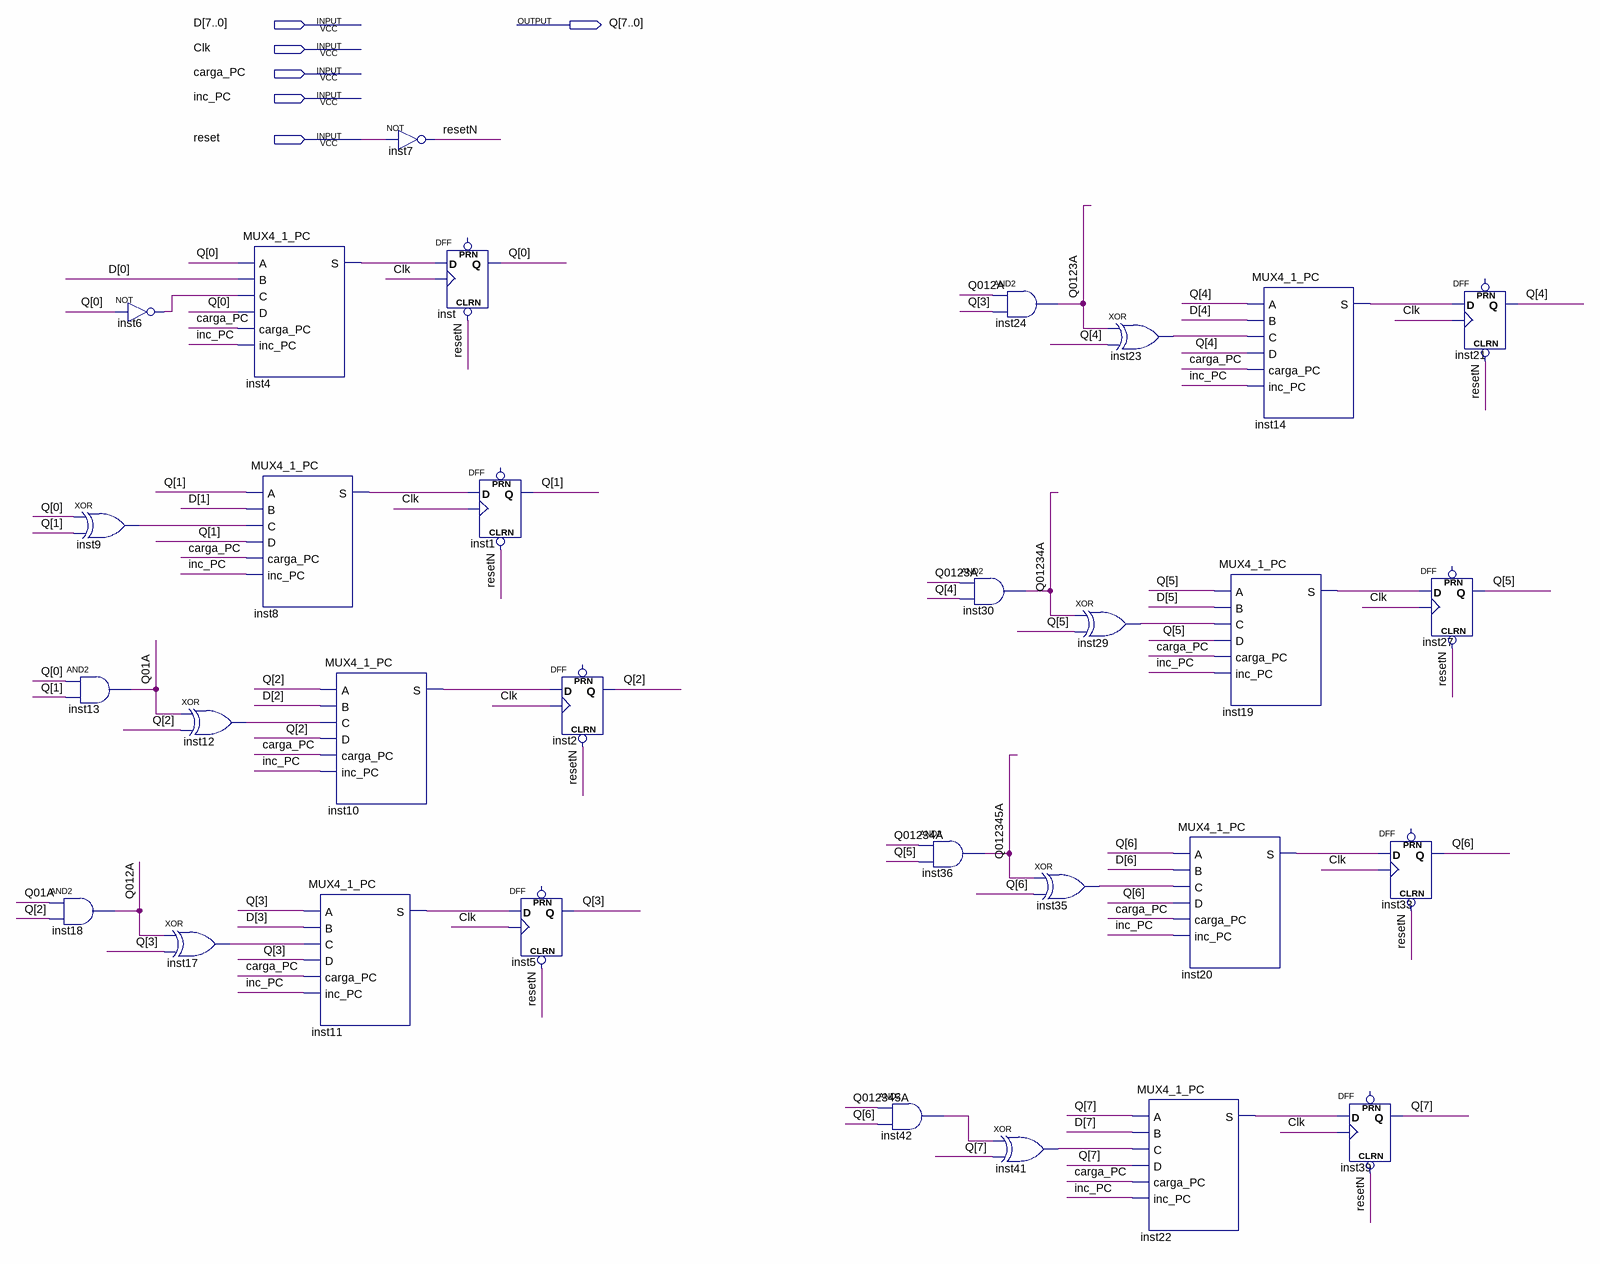
[diagram p0: schematic sheet]
// Quartus schematic PC.bdf as structural Verilog: 31 symbols, 6 pins
module PC (
  input  [7:0] D,
  input  Clk,
  input  carga_PC,
  input  inc_PC,
  input  reset,
  output [7:0] Q
);

  wire inst4_s, inst6_out, inst8_s, inst9_out, inst10_s, inst11_s, inst12_out, inst14_s, inst17_out,
       inst19_s, inst20_s, inst22_s, inst23_out, inst29_out, inst35_out, inst41_out, inst42_out, Q01A, Q012A,
       Q0123A, Q01234A, Q012345A, resetN;

  xor inst9 (inst9_out, Q[0], Q[1]);
  and inst13 (Q01A, Q[0], Q[1]);
  and inst18 (Q012A, Q01A, Q[2]);
  not inst6 (inst6_out, Q[0]);
  xor inst17 (inst17_out, Q012A, Q[3]);
  MUX4_1_PC inst4 (.A(Q[0]), .B(D[0]), .C(inst6_out), .D(Q[0]), .carga_PC(carga_PC), .inc_PC(inc_PC), .S(inst4_s));
  xor inst12 (inst12_out, Q01A, Q[2]);
  MUX4_1_PC inst8 (.A(Q[1]), .B(D[1]), .C(inst9_out), .D(Q[1]), .carga_PC(carga_PC), .inc_PC(inc_PC), .S(inst8_s));
  MUX4_1_PC inst11 (.A(Q[3]), .B(D[3]), .C(inst17_out), .D(Q[3]), .carga_PC(carga_PC), .inc_PC(inc_PC), .S(inst11_s));
  MUX4_1_PC inst10 (.A(Q[2]), .B(D[2]), .C(inst12_out), .D(Q[2]), .carga_PC(carga_PC), .inc_PC(inc_PC), .S(inst10_s));
  not inst7 (resetN, reset);
  DFF inst (.CLRN(resetN), .CLK(Clk), .D(inst4_s), .Q(Q[0]));  // open: PRN
  DFF inst1 (.CLRN(resetN), .CLK(Clk), .D(inst8_s), .Q(Q[1]));  // open: PRN
  DFF inst2 (.CLRN(resetN), .CLK(Clk), .D(inst10_s), .Q(Q[2]));  // open: PRN
  DFF inst5 (.CLRN(resetN), .CLK(Clk), .D(inst11_s), .Q(Q[3]));  // open: PRN
  and inst42 (inst42_out, Q012345A, Q[6]);
  and inst30 (Q01234A, Q0123A, Q[4]);
  and inst36 (Q012345A, Q01234A, Q[5]);
  and inst24 (Q0123A, Q012A, Q[3]);
  xor inst41 (inst41_out, inst42_out, Q[7]);
  xor inst29 (inst29_out, Q01234A, Q[5]);
  xor inst35 (inst35_out, Q012345A, Q[6]);
  xor inst23 (inst23_out, Q0123A, Q[4]);
  MUX4_1_PC inst22 (.A(Q[7]), .B(D[7]), .C(inst41_out), .D(Q[7]), .carga_PC(carga_PC), .inc_PC(inc_PC), .S(inst22_s));
  MUX4_1_PC inst19 (.A(Q[5]), .B(D[5]), .C(inst29_out), .D(Q[5]), .carga_PC(carga_PC), .inc_PC(inc_PC), .S(inst19_s));
  MUX4_1_PC inst20 (.A(Q[6]), .B(D[6]), .C(inst35_out), .D(Q[6]), .carga_PC(carga_PC), .inc_PC(inc_PC), .S(inst20_s));
  MUX4_1_PC inst14 (.A(Q[4]), .B(D[4]), .C(inst23_out), .D(Q[4]), .carga_PC(carga_PC), .inc_PC(inc_PC), .S(inst14_s));
  DFF inst39 (.CLRN(resetN), .CLK(Clk), .D(inst22_s), .Q(Q[7]));  // open: PRN
  DFF inst27 (.CLRN(resetN), .CLK(Clk), .D(inst19_s), .Q(Q[5]));  // open: PRN
  DFF inst33 (.CLRN(resetN), .CLK(Clk), .D(inst20_s), .Q(Q[6]));  // open: PRN
  DFF inst21 (.CLRN(resetN), .CLK(Clk), .D(inst14_s), .Q(Q[4]));  // open: PRN
endmodule
